# Altium project 3DAS_4Camera.PrjPcb (part 6 of 10)

## Sheet [11] HUB USB3.0.SchDoc
size A3; DocumentNumber: 11; SheetNumber: 11; SheetTotal: 16
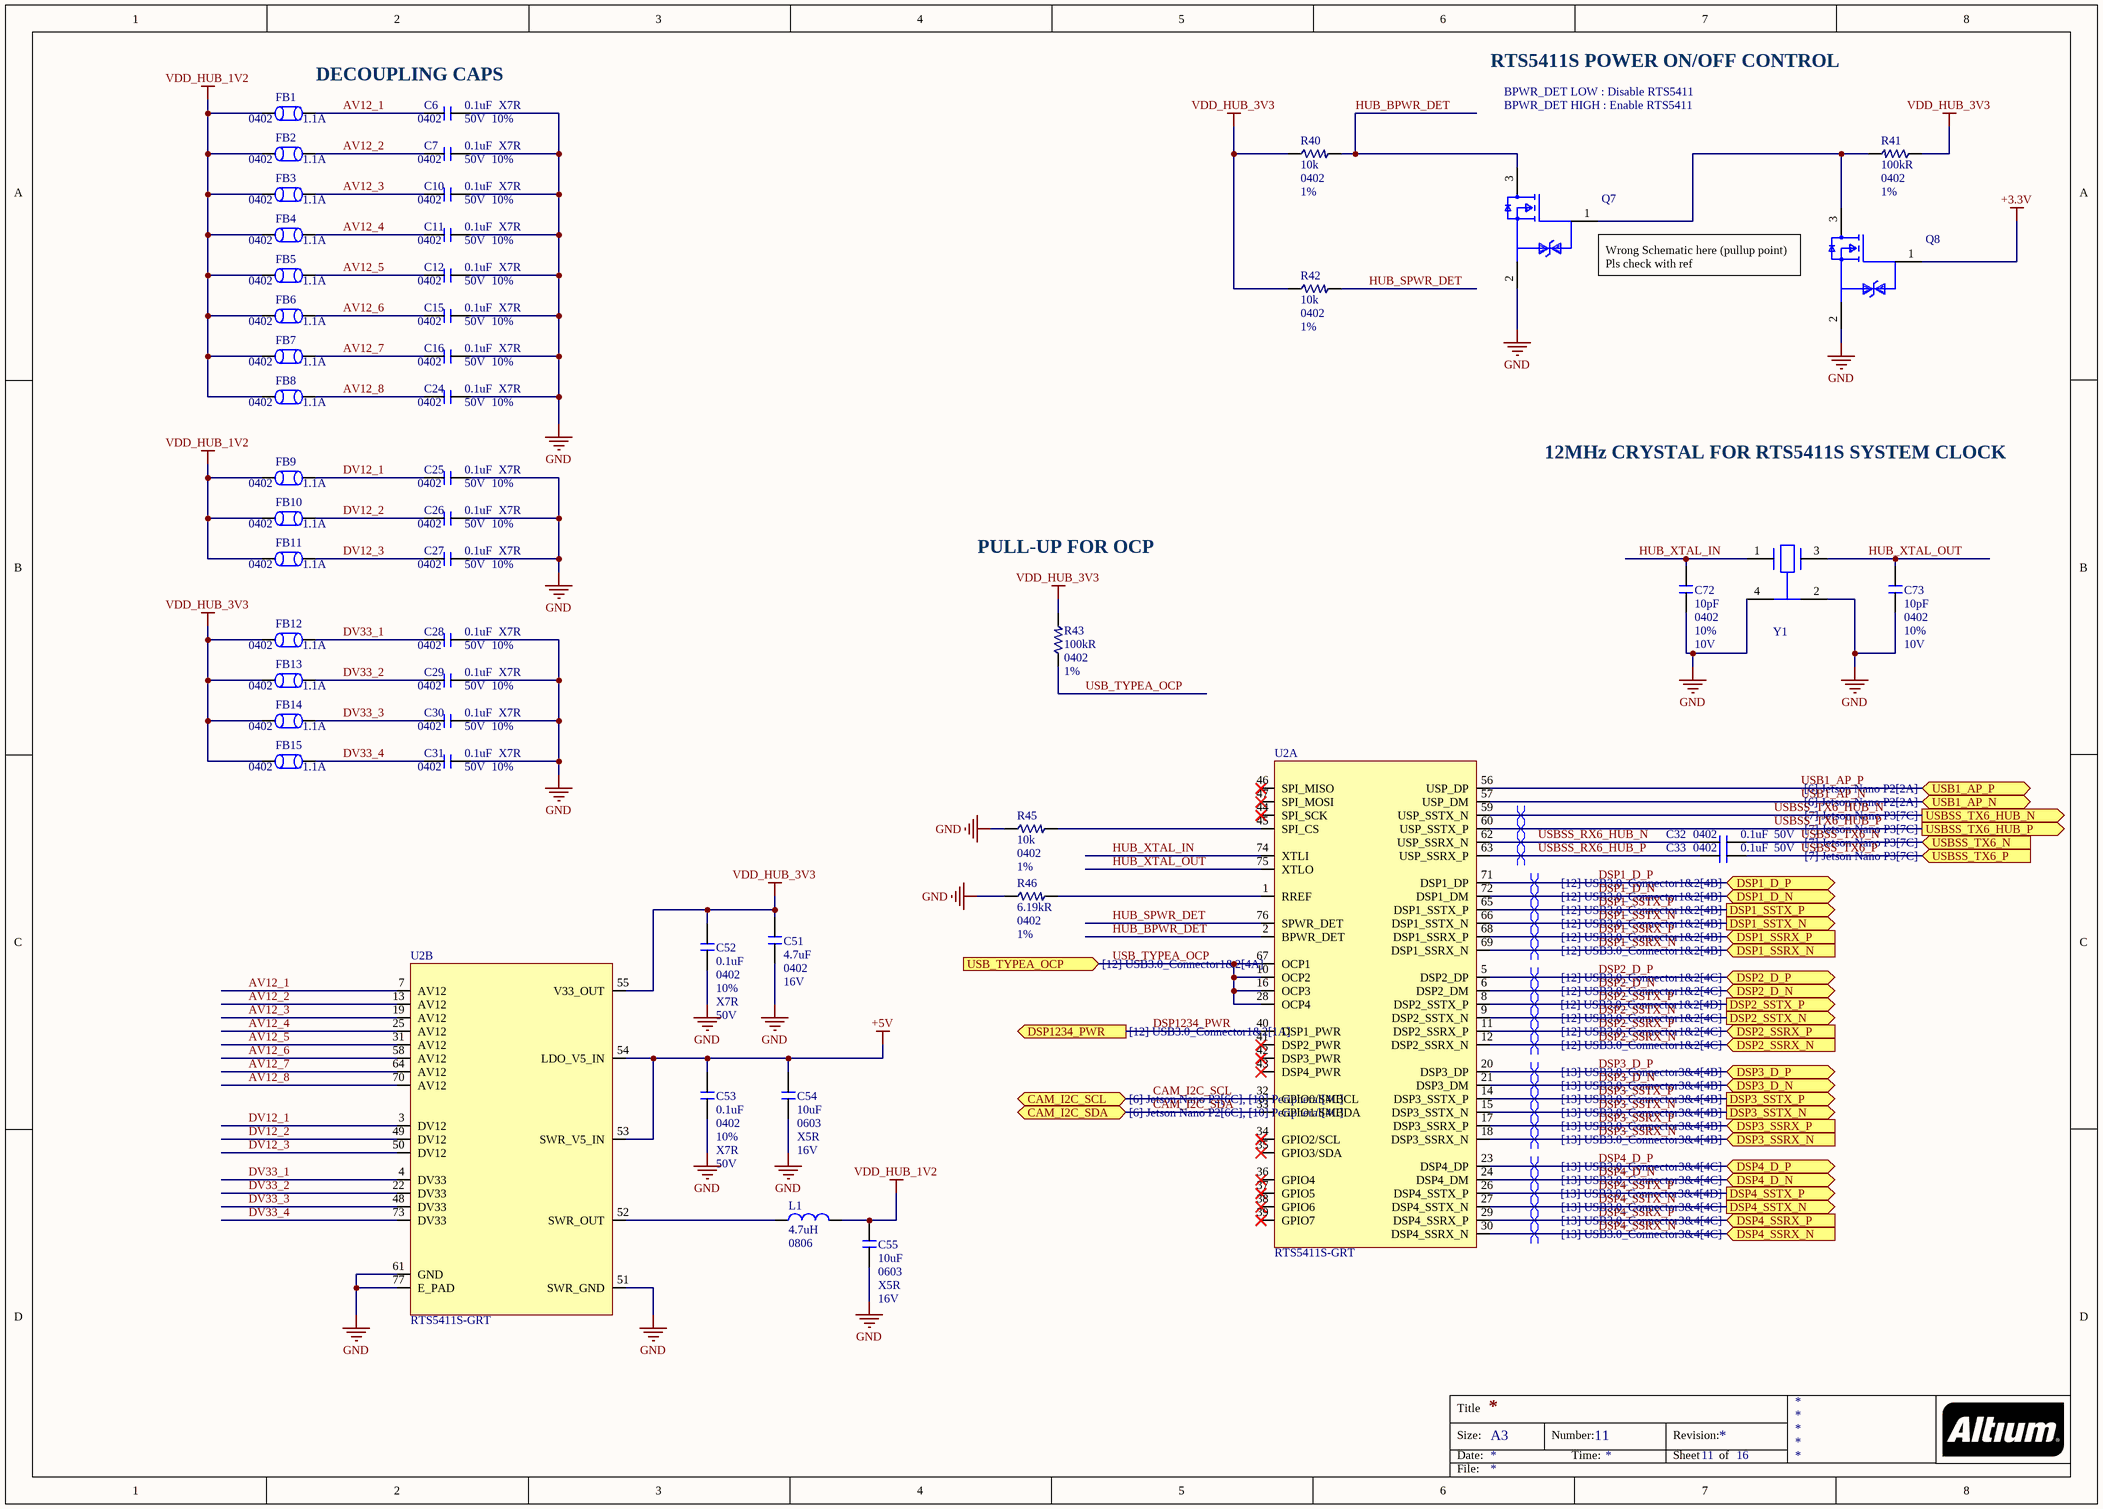
[diagram p10: [11] HUB USB3.0.SchDoc]

### Parts
C6  0.1uF  Case/Package: 0402  Tolerance: 10%  Dielectric: X7R  Voltage: 50V  [C0402M]
C7  0.1uF  Case/Package: 0402  Tolerance: 10%  Dielectric: X7R  Voltage: 50V  [C0402M]
C10  0.1uF  Case/Package: 0402  Tolerance: 10%  Dielectric: X7R  Voltage: 50V  [C0402M]
C11  0.1uF  Case/Package: 0402  Tolerance: 10%  Dielectric: X7R  Voltage: 50V  [C0402M]
C12  0.1uF  Case/Package: 0402  Tolerance: 10%  Dielectric: X7R  Voltage: 50V  [C0402M]
C15  0.1uF  Case/Package: 0402  Tolerance: 10%  Dielectric: X7R  Voltage: 50V  [C0402M]
C16  0.1uF  Case/Package: 0402  Tolerance: 10%  Dielectric: X7R  Voltage: 50V  [C0402M]
C24  0.1uF  Case/Package: 0402  Tolerance: 10%  Dielectric: X7R  Voltage: 50V  [C0402M]
C25  0.1uF  Case/Package: 0402  Tolerance: 10%  Dielectric: X7R  Voltage: 50V  [C0402M]
C26  0.1uF  Case/Package: 0402  Tolerance: 10%  Dielectric: X7R  Voltage: 50V  [C0402M]
C27  0.1uF  Case/Package: 0402  Tolerance: 10%  Dielectric: X7R  Voltage: 50V  [C0402M]
C28  0.1uF  Case/Package: 0402  Tolerance: 10%  Dielectric: X7R  Voltage: 50V  [C0402M]
C29  0.1uF  Case/Package: 0402  Tolerance: 10%  Dielectric: X7R  Voltage: 50V  [C0402M]
C30  0.1uF  Case/Package: 0402  Tolerance: 10%  Dielectric: X7R  Voltage: 50V  [C0402M]
C31  0.1uF  Case/Package: 0402  Tolerance: 10%  Dielectric: X7R  Voltage: 50V  [C0402M]
C32  0.1uF  Case/Package: 0402  Voltage: 50V  [C0402M]
C33  0.1uF  Case/Package: 0402  Voltage: 50V  [C0402M]
C51  4.7uF  Case/Package: 0402  Voltage Rating: 16V  [C0402M]
C52  0.1uF  Case/Package: 0402  Tolerance: 10%  Dielectric: X7R  Voltage: 50V  [C0402M]
C53  0.1uF  Case/Package: 0402  Tolerance: 10%  Dielectric: X7R  Voltage: 50V  [C0402M]
C54  10uF  Case/Package: 0603  Dielectric: X5R  Voltage Rating (DC): 16V  [C0603M]
C55  10uF  Case/Package: 0603  Dielectric: X5R  Voltage Rating (DC): 16V  [C0603M]
C72  10pF  Case/Package: 0402  Tolerance: 10%  Voltage Rating: 10V  [C0402M]
C73  10pF  Case/Package: 0402  Tolerance: 10%  Voltage Rating: 10V  [C0402M]
FB1  Case Code (Imperial): 0402  Current Rating: 1.1A  [R0402M]  (hidden comment: BLM15AX300SN1D)
FB2  Case Code (Imperial): 0402  Current Rating: 1.1A  [R0402M]  (hidden comment: BLM15AX300SN1D)
FB3  Case Code (Imperial): 0402  Current Rating: 1.1A  [R0402M]  (hidden comment: BLM15AX300SN1D)
FB4  Case Code (Imperial): 0402  Current Rating: 1.1A  [R0402M]  (hidden comment: BLM15AX300SN1D)
FB5  Case Code (Imperial): 0402  Current Rating: 1.1A  [R0402M]  (hidden comment: BLM15AX300SN1D)
FB6  Case Code (Imperial): 0402  Current Rating: 1.1A  [R0402M]  (hidden comment: BLM15AX300SN1D)
FB7  Case Code (Imperial): 0402  Current Rating: 1.1A  [R0402M]  (hidden comment: BLM15AX300SN1D)
FB8  Case Code (Imperial): 0402  Current Rating: 1.1A  [R0402M]  (hidden comment: BLM15AX300SN1D)
FB9  Case Code (Imperial): 0402  Current Rating: 1.1A  [R0402M]  (hidden comment: BLM15AX300SN1D)
FB10  Case Code (Imperial): 0402  Current Rating: 1.1A  [R0402M]  (hidden comment: BLM15AX300SN1D)
FB11  Case Code (Imperial): 0402  Current Rating: 1.1A  [R0402M]  (hidden comment: BLM15AX300SN1D)
FB12  Case Code (Imperial): 0402  Current Rating: 1.1A  [R0402M]  (hidden comment: BLM15AX300SN1D)
FB13  Case Code (Imperial): 0402  Current Rating: 1.1A  [R0402M]  (hidden comment: BLM15AX300SN1D)
FB14  Case Code (Imperial): 0402  Current Rating: 1.1A  [R0402M]  (hidden comment: BLM15AX300SN1D)
FB15  Case Code (Imperial): 0402  Current Rating: 1.1A  [R0402M]  (hidden comment: BLM15AX300SN1D)
L1  4.7uH  Case Code (Imperial): 0806  [IND_0805]
Q7  DMN26D0UFB4-7  [Diodes_Inc_X2-DFN1006-3_MFG]  (value not drawn)
Q8  DMN26D0UFB4-7  [Diodes_Inc_X2-DFN1006-3_MFG]  (value not drawn)
R40  10k  Case Code (Imperial): 0402  Tolerance: 1%  [R0402M]
R41  100kR  Case/Package: 0402  Tolerance: 1%  [R0402M]
R42  10k  Case Code (Imperial): 0402  Tolerance: 1%  [R0402M]
R43  100kR  Case/Package: 0402  Tolerance: 1%  [R0402M]
R45  10k  Case Code (Imperial): 0402  Tolerance: 1%  [R0402M]
R46  6.19kR  Case/Package: 0402  Tolerance: 1%  [R0402M]
U2  RTS5411S-GRT  [QFN40P900X900X90_HS-77N]  (parts A,B of 2)
Y1  ABM8G-12.000MHZ-4Y-T3  [Abracon_ABM8G_0]  (value not drawn)

### Ports
CAM_I2C_SCL (bidir, see [6] Jetson Nano P2[6C], [10] Peripheral[4C]), CAM_I2C_SDA (bidir, see [6] Jetson Nano P2[6C], [10] Peripheral[4C]), DSP1_D_N (bidir, see [12] USB3.0_Connector1&2[4B]), DSP1_D_P (bidir, see [12] USB3.0_Connector1&2[4B]), DSP1_SSRX_N (in, see [12] USB3.0_Connector1&2[4B]), DSP1_SSRX_P (in, see [12] USB3.0_Connector1&2[4B]), DSP1_SSTX_N (out, see [12] USB3.0_Connector1&2[4B]), DSP1_SSTX_P (out, see [12] USB3.0_Connector1&2[4B]), DSP2_D_N (bidir, see [12] USB3.0_Connector1&2[4C]), DSP2_D_P (bidir, see [12] USB3.0_Connector1&2[4C]), DSP2_SSRX_N (in, see [12] USB3.0_Connector1&2[4C]), DSP2_SSRX_P (in, see [12] USB3.0_Connector1&2[4C]), DSP2_SSTX_N (out, see [12] USB3.0_Connector1&2[4C]), DSP2_SSTX_P (out, see [12] USB3.0_Connector1&2[4D]), DSP3_D_N (bidir, see [13] USB3.0_Connector3&4[4B]), DSP3_D_P (bidir, see [13] USB3.0_Connector3&4[4B]), DSP3_SSRX_N (in, see [13] USB3.0_Connector3&4[4B]), DSP3_SSRX_P (in, see [13] USB3.0_Connector3&4[4B]), DSP3_SSTX_N (out, see [13] USB3.0_Connector3&4[4B]), DSP3_SSTX_P (out, see [13] USB3.0_Connector3&4[4B]), DSP4_D_N (bidir, see [13] USB3.0_Connector3&4[4C]), DSP4_D_P (bidir, see [13] USB3.0_Connector3&4[4C]), DSP4_SSRX_N (in, see [13] USB3.0_Connector3&4[4C]), DSP4_SSRX_P (in, see [13] USB3.0_Connector3&4[4C]), DSP4_SSTX_N (out, see [13] USB3.0_Connector3&4[4C]), DSP4_SSTX_P (out, see [13] USB3.0_Connector3&4[4D]), DSP1234_PWR (out, see [12] USB3.0_Connector1&2[1A]), USB1_AP_N (bidir, see [6] Jetson Nano P2[2A]), USB1_AP_P (bidir, see [6] Jetson Nano P2[2A]), USB_TYPEA_OCP (in, see [12] USB3.0_Connector1&2[4A]), USBSS_TX6_HUB_N (out, see [7] Jetson Nano P3[7C]), USBSS_TX6_HUB_P (out, see [7] Jetson Nano P3[7C]), USBSS_TX6_N (in, see [7] Jetson Nano P3[7C]), USBSS_TX6_P (in, see [7] Jetson Nano P3[7C])

### Nets
+3.3V: Q8.1(G)
+5V: C53.1 C54.2 U2.53(SWR_V5_IN) U2.54(LDO_V5_IN)
GND: C6.2 C7.2 C10.2 C11.2 C12.2 C15.2 C16.2 C24.2 C25.2 C26.2 C27.2 C28.2 C29.2 C30.2 C31.2 C51.2 C52.2 C53.2 C54.1 C55.1 C72.2 C73.2 Q7.2(S) Q8.2(S) R45.2 R46.2 U2.51(SWR_GND) U2.61(GND) U2.77(E_PAD) Y1.2(GND) Y1.4(GND)
VDD_HUB_1V2: C55.2 FB1.2 FB2.2 FB3.2 FB4.2 FB5.2 FB6.2 FB7.2 FB8.2 FB9.2 FB10.2 FB11.2 L1.2
VDD_HUB_3V3: C51.1 C52.1 FB12.2 FB13.2 FB14.2 FB15.2 R40.2 R41.2 R42.2 R43.1 U2.55(V33_OUT)
AV12_1: C6.1 FB1.1 U2.7(AV12)
AV12_2: C7.1 FB2.1 U2.13(AV12)
AV12_3: C10.1 FB3.1 U2.19(AV12)
AV12_4: C11.1 FB4.1 U2.25(AV12)
AV12_5: C12.1 FB5.1 U2.31(AV12)
AV12_6: C15.1 FB6.1 U2.58(AV12)
AV12_7: C16.1 FB7.1 U2.64(AV12)
AV12_8: C24.1 FB8.1 U2.70(AV12)
CAM_I2C_SCL: U2.32(GPIO0/SMBCL) ; port CAM_I2C_SCL
CAM_I2C_SDA: U2.33(GPIO1/SMBDA) ; port CAM_I2C_SDA
DSP1_D_N: U2.72(DSP1_DM) ; port DSP1_D_N
DSP1_D_P: U2.71(DSP1_DP) ; port DSP1_D_P
DSP1_SSRX_N: U2.69(DSP1_SSRX_N) ; port DSP1_SSRX_N
DSP1_SSRX_P: U2.68(DSP1_SSRX_P) ; port DSP1_SSRX_P
DSP1_SSTX_N: U2.66(DSP1_SSTX_N) ; port DSP1_SSTX_N
DSP1_SSTX_P: U2.65(DSP1_SSTX_P) ; port DSP1_SSTX_P
DSP2_D_N: U2.6(DSP2_DM) ; port DSP2_D_N
DSP2_D_P: U2.5(DSP2_DP) ; port DSP2_D_P
DSP2_SSRX_N: U2.12(DSP2_SSRX_N) ; port DSP2_SSRX_N
DSP2_SSRX_P: U2.11(DSP2_SSRX_P) ; port DSP2_SSRX_P
DSP2_SSTX_N: U2.9(DSP2_SSTX_N) ; port DSP2_SSTX_N
DSP2_SSTX_P: U2.8(DSP2_SSTX_P) ; port DSP2_SSTX_P
DSP3_D_N: U2.21(DSP3_DM) ; port DSP3_D_N
DSP3_D_P: U2.20(DSP3_DP) ; port DSP3_D_P
DSP3_SSRX_N: U2.18(DSP3_SSRX_N) ; port DSP3_SSRX_N
DSP3_SSRX_P: U2.17(DSP3_SSRX_P) ; port DSP3_SSRX_P
DSP3_SSTX_N: U2.15(DSP3_SSTX_N) ; port DSP3_SSTX_N
DSP3_SSTX_P: U2.14(DSP3_SSTX_P) ; port DSP3_SSTX_P
DSP4_D_N: U2.24(DSP4_DM) ; port DSP4_D_N
DSP4_D_P: U2.23(DSP4_DP) ; port DSP4_D_P
DSP4_SSRX_N: U2.30(DSP4_SSRX_N) ; port DSP4_SSRX_N
DSP4_SSRX_P: U2.29(DSP4_SSRX_P) ; port DSP4_SSRX_P
DSP4_SSTX_N: U2.27(DSP4_SSTX_N) ; port DSP4_SSTX_N
DSP4_SSTX_P: U2.26(DSP4_SSTX_P) ; port DSP4_SSTX_P
DSP1234_PWR: U2.40(DSP1_PWR) ; port DSP1234_PWR
DV12_1: C25.1 FB9.1 U2.3(DV12)
DV12_2: C26.1 FB10.1 U2.49(DV12)
DV12_3: C27.1 FB11.1 U2.50(DV12)
DV33_1: C28.1 FB12.1 U2.4(DV33)
DV33_2: C29.1 FB13.1 U2.22(DV33)
DV33_3: C30.1 FB14.1 U2.48(DV33)
DV33_4: C31.1 FB15.1 U2.73(DV33)
HUB_BPWR_DET: Q7.3(D) R40.1 U2.2(BPWR_DET)
HUB_SPWR_DET: R42.1 U2.76(SPWR_DET)
HUB_XTAL_IN: C72.1 U2.74(XTLI) Y1.1
HUB_XTAL_OUT: C73.1 U2.75(XTLO) Y1.3
USB1_AP_N: U2.57(USP_DM) ; port USB1_AP_N
USB1_AP_P: U2.56(USP_DP) ; port USB1_AP_P
USB_TYPEA_OCP: R43.2 U2.10(OCP2) U2.16(OCP3) U2.28(OCP4) U2.67(OCP1) ; port USB_TYPEA_OCP
USBSS_RX6_HUB_N: C32.1 U2.62(USP_SSRX_N)
USBSS_RX6_HUB_P: C33.1 U2.63(USP_SSRX_P)
USBSS_TX6_HUB_N: U2.59(USP_SSTX_N) ; port USBSS_TX6_HUB_N
USBSS_TX6_HUB_P: U2.60(USP_SSTX_P) ; port USBSS_TX6_HUB_P
USBSS_TX6_N: C32.2 ; port USBSS_TX6_N
USBSS_TX6_P: C33.2 ; port USBSS_TX6_P
NetL1_1: L1.1 U2.52(SWR_OUT)
NetQ7_1: Q7.1(G) Q8.3(D) R41.1
NetR45_1: R45.1 U2.45(SPI_CS)
NetR46_1: R46.1 U2.1(RREF)

Not connected (* = marked no-connect by the designer): U2 34(GPIO2/SCL)* 35(GPIO3/SDA)* 36(GPIO4)* 37(GPIO5)* 38(GPIO6)* 39(GPIO7)* 41(DSP2_PWR)* 42(DSP3_PWR)* 43(DSP4_PWR)* 44(SPI_SCK)* 46(SPI_MISO)* 47(SPI_MOSI)*

### Layout directives
differential pair; differential pair class DIFF100; net class DIFF100: DSP1_D_N, DSP1_D_P, DSP1_SSRX_N, DSP1_SSRX_P, DSP1_SSTX_N, DSP1_SSTX_P, DSP2_D_N, DSP2_D_P, DSP2_SSRX_N, DSP2_SSRX_P, DSP2_SSTX_N, DSP2_SSTX_P, DSP3_D_N, DSP3_D_P, DSP3_SSRX_N, DSP3_SSRX_P, DSP3_SSTX_N, DSP3_SSTX_P, DSP4_D_N, DSP4_D_P, DSP4_SSRX_N, DSP4_SSRX_P, DSP4_SSTX_N, DSP4_SSTX_P, USBSS_RX6_HUB_N, USBSS_RX6_HUB_P, USBSS_TX6_HUB_N, USBSS_TX6_HUB_P

### Notes on the sheet
- DECOUPLING CAPS
- RTS5411S POWER ON/OFF CONTROL
- BPWR_DET LOW : Disable RTS5411
- BPWR_DET HIGH : Enable RTS5411
- Wrong Schematic here (pullup point)
  Pls check with ref
- 12MHz CRYSTAL FOR RTS5411S SYSTEM CLOCK
- PULL-UP FOR OCP
- Title
- Size:
- Date:
- A3
- Number:
- Time:
- Revision:
- Sheet
- of
- File:

### Library data of the parts
C6 C7 C10-C12 C15 C16 C24-C31 C52 C53 = CAP_CER: CAP CER 0.1UF 50V X7R 0402; Manufacturer: Murata; Manufacturer Part Number: GRM155R71H104KE14D; Material: Ceramic; Capacitance: 100nF; Dissipation Factor: 0.025%; ComponentLink1URL: https://datasheet.ciiva.com/25741/cl10b104kb8nnnl-25741341.pdf?src-supplier=Digi-Key; ComponentLink1Description: https://datasheet.ciiva.com/25741/cl10b104kb8nnnl-25741341.pdf?src-supplier=Digi-Key; ComponentLink2URL: https://datasheet.ciiva.com/26838/getdatasheetpartid-357523-26838415.pdf?src-supplier=Verical; ComponentLink2Description: https://datasheet.ciiva.com/26838/getdatasheetpartid-357523-26838415.pdf?src-supplier=Verical; Supplier 1: Digi-Key; Supplier Part Number 1: 490-10700-1-ND; Stock 1: 2282266; Pricing 1: 1 = 0.10000, 10 = 0.04600, 100 = 0.02050, 500 = 0.01464, 1000 = 0.01150, 2500 = 0.01045, 5000 = 0.00961 (USD); RoHS: Yes; Mount: Surface Mount; Weight: 0.000212oz; Case Code (Metric): 1005; Case Code (Imperial): 0402; Dielectric Material: Ceramic; Min Operating Temperature: -55°C; Max Operating Temperature: 125°C; Packaging: Tape and Reel; Voltage Rating: 50V; Termination: SMD/SMT; Composition: Ceramic; Voltage Rating (DC): 50V; Package Quantity: 10000; Length: 1mm; Height: 0.5mm; Width: 0.5mm; Thickness: 0.022inch; Depth: 0.5mm; REACH SVHC: No SVHC; Lead Free: Lead Free; ComponentLink3URL: http://www.farnell.com/datasheets/2079156.pdf?src-supplier=Farnell; ComponentLink3Description: http://www.farnell.com/datasheets/2079156.pdf?src-supplier=Farnell; ComponentLink4URL: http://www.mouser.com/ds/2/281/c02e-2905.pdf?src-supplier=Mouser; ComponentLink4Description: http://www.mouser.com/ds/2/281/c02e-2905.pdf?src-supplier=Mouser; ComponentLink5URL: http://components.arrow.com/part/dataview/0323_07030614?src-supplier=Arrow+Europe; ComponentLink5Description: http://components.arrow.com/part/dataview/0323_07030614?src-supplier=Arrow+Europe; ComponentLink6URL: https://search.murata.co.jp/Ceramy/image/img/A01X/G101/ENG/GRM155R71H104KE14-01.pdf?src-supplier=Digi-Key; ComponentLink6Description: https://search.murata.co.jp/Ceramy/image/img/A01X/G101/ENG/GRM155R71H104KE14-01.pdf?src-supplier=Digi-Key; ComponentLink7URL: http://psearch.en.murata.com/capacitor/product/GRM155R71H104KE14%23.pdf?src-supplier=Avnet; ComponentLink7Description: http://psearch.en.murata.com/capacitor/product/GRM155R71H104KE14%23.pdf?src-supplier=Avnet; ComponentLink8URL: http://www.farnell.com/datasheets/2079156.pdf?src-supplier=Element14; ComponentLink8Description: http://www.farnell.com/datasheets/2079156.pdf?src-supplier=Element14; ComponentLink9URL: http://www.farnell.com/datasheets/2079156.pdf?src-supplier=Newark; ComponentLink9Description: http://www.farnell.com/datasheets/2079156.pdf?src-supplier=Newark
C32 C33 = CAP_CER: CAP CER 0.1UF 50V X7R 0402; Manufacturer: Murata; Manufacturer Part Number: GRM155R71H104KE14D; Material: Ceramic; Tolerance: 10%; Capacitance: 100nF; Dissipation Factor: 0.025%; ComponentLink1URL: https://datasheet.ciiva.com/25741/cl10b104kb8nnnl-25741341.pdf?src-supplier=Digi-Key; ComponentLink1Description: https://datasheet.ciiva.com/25741/cl10b104kb8nnnl-25741341.pdf?src-supplier=Digi-Key; ComponentLink2URL: https://datasheet.ciiva.com/26838/getdatasheetpartid-357523-26838415.pdf?src-supplier=Verical; ComponentLink2Description: https://datasheet.ciiva.com/26838/getdatasheetpartid-357523-26838415.pdf?src-supplier=Verical; Supplier 1: Digi-Key; Supplier Part Number 1: 490-10700-1-ND; Stock 1: 2282266; Pricing 1: 1 = 0.10000, 10 = 0.04600, 100 = 0.02050, 500 = 0.01464, 1000 = 0.01150, 2500 = 0.01045, 5000 = 0.00961 (USD); RoHS: Yes; Mount: Surface Mount; Weight: 0.000212oz; Case Code (Metric): 1005; Case Code (Imperial): 0402; Dielectric Material: Ceramic; Min Operating Temperature: -55°C; Max Operating Temperature: 125°C; Packaging: Tape and Reel; Dielectric: X7R; Voltage Rating: 50V; Termination: SMD/SMT; Composition: Ceramic; Voltage Rating (DC): 50V; Package Quantity: 10000; Length: 1mm; Height: 0.5mm; Width: 0.5mm; Thickness: 0.022inch; Depth: 0.5mm; REACH SVHC: No SVHC; Lead Free: Lead Free; ComponentLink3URL: http://www.farnell.com/datasheets/2079156.pdf?src-supplier=Farnell; ComponentLink3Description: http://www.farnell.com/datasheets/2079156.pdf?src-supplier=Farnell; ComponentLink4URL: http://www.mouser.com/ds/2/281/c02e-2905.pdf?src-supplier=Mouser; ComponentLink4Description: http://www.mouser.com/ds/2/281/c02e-2905.pdf?src-supplier=Mouser; ComponentLink5URL: http://components.arrow.com/part/dataview/0323_07030614?src-supplier=Arrow+Europe; ComponentLink5Description: http://components.arrow.com/part/dataview/0323_07030614?src-supplier=Arrow+Europe; ComponentLink6URL: https://search.murata.co.jp/Ceramy/image/img/A01X/G101/ENG/GRM155R71H104KE14-01.pdf?src-supplier=Digi-Key; ComponentLink6Description: https://search.murata.co.jp/Ceramy/image/img/A01X/G101/ENG/GRM155R71H104KE14-01.pdf?src-supplier=Digi-Key; ComponentLink7URL: http://psearch.en.murata.com/capacitor/product/GRM155R71H104KE14%23.pdf?src-supplier=Avnet; ComponentLink7Description: http://psearch.en.murata.com/capacitor/product/GRM155R71H104KE14%23.pdf?src-supplier=Avnet; ComponentLink8URL: http://www.farnell.com/datasheets/2079156.pdf?src-supplier=Element14; ComponentLink8Description: http://www.farnell.com/datasheets/2079156.pdf?src-supplier=Element14; ComponentLink9URL: http://www.farnell.com/datasheets/2079156.pdf?src-supplier=Newark; ComponentLink9Description: http://www.farnell.com/datasheets/2079156.pdf?src-supplier=Newark
C51 = CAP_CER: CAP CER 4.7UF 16V X5R 0402; Manufacturer: Samsung; Manufacturer Part Number: CL05A475MO5NUNC; Tolerance: 20%; ComponentLink1URL: https://datasheet.ciiva.com/25786/cl05a475mp5nrnc-25786963.pdf?src-supplier=Digi-Key; ComponentLink1Description: https://datasheet.ciiva.com/25786/cl05a475mp5nrnc-25786963.pdf?src-supplier=Digi-Key; ComponentLink2URL: https://datasheet.ciiva.com/16437/cl05b104kq5nnnc-16437353.pdf?src-supplier=Future+Electronics; ComponentLink2Description: https://datasheet.ciiva.com/16437/cl05b104kq5nnnc-16437353.pdf?src-supplier=Future+Electronics; Supplier 1: Digi-Key; Supplier Part Number 1: 1276-6836-6-ND; Stock 1: 1677309; Pricing 1: 1 = 0.45000, 10 = 0.32100, 100 = 0.21130, 500 = 0.15656, 1000 = 0.13307, 2500 = 0.12524, 5000 = 0.11741 (USD); RoHS: Yes; Mount: Surface Mount; Case Code (Imperial): 0402; Case Code (Metric): 1005; Min Operating Temperature: -55°C; Max Operating Temperature: 85°C; Packaging: Tape and Reel; Capacitance: 4.7uF; Length: 0.039inch; Width: 0.02inch; Thickness: 0.022inch; ComponentLink3URL: http://www.farnell.com/datasheets/2710653.pdf?src-supplier=Farnell; ComponentLink3Description: http://www.farnell.com/datasheets/2710653.pdf?src-supplier=Farnell; ComponentLink4URL: http://www.farnell.com/datasheets/2710653.pdf?src-supplier=Newark; ComponentLink4Description: http://www.farnell.com/datasheets/2710653.pdf?src-supplier=Newark; ComponentLink5URL: http://www.samsungsem.com/kr/support/product-search/mlcc/CL05A475MO5NUNC.jsp?src-supplier=Digi-Key; ComponentLink5Description: http://www.samsungsem.com/kr/support/product-search/mlcc/CL05A475MO5NUNC.jsp?src-supplier=Digi-Key
C54 C55 = CAP_CER: CAP CER 10UF 16V X5R 0603; Manufacturer: Taiyo Yuden; Manufacturer Part Number: EMK107BBJ106MA-T; Tolerance: 20%; Supplier 1: Digi-Key; Supplier Part Number 1: 587-3238-1-ND; RoHS: Yes; Category: Ceramic Capacitors; Stock 1: 599529; Pricing 1: 1=0.34000, 10=0.23400, 50=0.16400, 100=0.14060, 500=0.10544, 1000=0.08903 (USD); Mount: Surface Mount; Case Code (Metric): 1608; Case Code (Imperial): 0603; Min Operating Temperature: -55°C; Max Operating Temperature: 85°C; Capacitance: 10uF; Packaging: Tape and Reel; Voltage Rating: 16V; Package Quantity: 1; Termination: SMD/SMT; Series: M; Construction: Flat; Length: 0.063inch; Width: 0.031inch; Height: 0.8mm; Thickness: 0.031inch; RoHS Compliant: Yes; REACH SVHC: Unknown; Halogen Free: Halogen Free; ComponentLink1URL: https://datasheet.ciiva.com/6259/emk107bbj106ma-t-6259169.pdf?src-supplier=Digi-Key; ComponentLink1Description: https://datasheet.ciiva.com/6259/emk107bbj106ma-t-6259169.pdf?src-supplier=Digi-Key; ComponentLink2URL: https://datasheet.ciiva.com/15920/3emk107bbj106ma-t-15920482.pdf?src-supplier=Onlinecomponents.com; ComponentLink2Description: https://datasheet.ciiva.com/15920/3emk107bbj106ma-t-15920482.pdf?src-supplier=Onlinecomponents.com; ComponentLink3URL: https://datasheet.ciiva.com/34372/463emk107bbj106ma-t-34372674.pdf?src-supplier=Onlinecomponents.com; ComponentLink3Description: https://datasheet.ciiva.com/34372/463emk107bbj106ma-t-34372674.pdf?src-supplier=Onlinecomponents.com; ComponentLink4URL: https://datasheet.ciiva.com/6259/emk107bbj106ma-t-6259164.pdf?src-supplier=Digi-Key; ComponentLink4Description: https://datasheet.ciiva.com/6259/emk107bbj106ma-t-6259164.pdf?src-supplier=Digi-Key; ComponentLink5URL: https://datasheet.ciiva.com/6259/emk107bbj106ma-t-6259167.pdf?src-supplier=Digi-Key; ComponentLink5Description: https://datasheet.ciiva.com/6259/emk107bbj106ma-t-6259167.pdf?src-supplier=Digi-Key; ComponentLink6URL: https://datasheet.ciiva.com/13168/mlcc01-e-13168735.pdf?src-supplier=Mouser; ComponentLink6Description: https://datasheet.ciiva.com/13168/mlcc01-e-13168735.pdf?src-supplier=Mouser
C72 C73 = CAP_CER: Capacitor, Ceramic, 10pF, 10VDC, 10-% Tol, 10+% Tol, C0G-TC Code, -30, 30ppm-TC RoHS Compliant: Yes; Manufacturer 1: KEMET; Manufacturer Part Number 1: C0402C100K8GACTU; Dielectric: C0G; Dissipation Factor: 0.1%; Supplier 1: Mouser; Supplier Part Number 1: 80-C0402C100K8G; Stock 1: 9650; Pricing 1: 1=0.36000, 10=0.16500, 50=0.16500, 100=0.14100, 1000=0.08700, 10000=0.06600 (USD); RoHS: Yes; Mount: Surface Mount; Dielectric Material: Ceramic; Case Code (Metric): 1005; Case Code (Imperial): 0402; Min Operating Temperature: -55°C; Max Operating Temperature: 125°C; Capacitance: 10pF; Packaging: Tape and Reel; Voltage Rating (DC): 10V; Package Quantity: 10000; Termination: SMD/SMT; Series: C; Length: 1mm; Width: 0.02inch; Height: 0.5mm; Depth: 0.5mm; Thickness: 0.022inch; Lead Pitch: 0.3mm; Lead Free: Lead Free; RoHS Compliant: Yes; ComponentLink1URL: https://datasheet.ciiva.com/5427/kem-c1003-c0g-smd-356956-5427030.pdf?src-supplier=Mouser; ComponentLink1Description: https://datasheet.ciiva.com/5427/kem-c1003-c0g-smd-356956-5427030.pdf?src-supplier=Mouser
FB1-FB15 = FB: 0402 30Ω ±25% DCR=0.06Ω 1.1A 应用：信号线与电源线-超低直流电阻; Manufacturer 1: Murata; Impedance: 30R; Number of Lines: 1; DC Resistance (DCR): 60mR; Test Frequency: 100MHz; Supplier 1: Newark; Supplier Part Number 1: 76AH5004; Manufacturer Part Number 1: BLM15AX300SN1D; Stock 1: 2189; Pricing 1: 10=0.05500, 25=0.04700, 50=0.03800, 100=0.03000 (USD); RoHS: Yes; Case/Package: 0402; Number of Pins: 2; Case Code (Metric): 1005; Min Operating Temperature: -55°C; Max Operating Temperature: 125°C; Package Quantity: 1; Tolerance: 25%; Packaging: Tape and Reel; Max Current Rating: 1.1A; Max DC Current: 1.1A; Termination: SMD/SMT; Number of Circuits: 1; Series: BLM15AX_SN; Length: 0.039inch; Width: 0.02inch; Height: 0.022inch; Lead Free: Lead Free; RoHS Compliant: Yes; ComponentLink1URL: https://datasheet.ciiva.com/1012/l0110e-1012360.pdf?src-supplier=Digi-Key; ComponentLink1Description: https://datasheet.ciiva.com/1012/l0110e-1012360.pdf?src-supplier=Digi-Key; ComponentLink2URL: https://datasheet.ciiva.com/1012/l0110e-1012359.pdf?src-supplier=Digi-Key; ComponentLink2Description: https://datasheet.ciiva.com/1012/l0110e-1012359.pdf?src-supplier=Digi-Key; ComponentLink3URL: https://datasheet.ciiva.com/1012/l0110e-1012361.pdf?src-supplier=Digi-Key; ComponentLink3Description: https://datasheet.ciiva.com/1012/l0110e-1012361.pdf?src-supplier=Digi-Key
L1 = IND_SMD: 0806 4.7uH ±30% DCR=0.175Ω 0.8A SRF=20MHz; Manufacturer 1: Murata; Manufacturer Part Number 1: LQM2MPN4R7NG0L; Value: 150 mH; Core Material: Ferrite; Self Resonant Frequency: 20MHz; Shielding: Shielded; Current Rating: 1.1A; DC Resistance (DCR): 175mR; Test Frequency: 1MHz; Supplier 1: RSComponents; Supplier Part Number 1: 7867150; Stock 1: 490; Pricing 1: 10=0.43000, 50=0.36500, 100=0.32300, 250=0.28100, 1000=0.25900 (USD); RoHS: Yes; Mount: Surface Mount; Case/Package: 0806; Case Code (Metric): 2016; Min Operating Temperature: -40°C; Max Operating Temperature: 125°C; Tolerance: 30%; Packaging: Tape and Reel; Package Quantity: 1; Inductance: 4.7uH; Max DC Current: 1.1A; Termination: SMD/SMT; DC Current: 1.1A; Inductance Tolerance: 30%; Series: LQM2MPN_G0; Length: 2mm; Width: 1.6mm; Height: 0.9mm; Height - Seated (Max): 0.039inch; Depth: 1.6mm; REACH SVHC: No SVHC; Military Standard: Not; Lead Free: Lead Free; RoHS Compliant: Yes; ComponentLink1URL: https://datasheet.ciiva.com/30490/0900766b812561f8-30490187.pdf?src-supplier=RSComponents; ComponentLink1Description: https://datasheet.ciiva.com/30490/0900766b812561f8-30490187.pdf?src-supplier=RSComponents; ComponentLink2URL: https://datasheet.ciiva.com/4956/l0075s0104lqm2mp-g0-4956096.pdf?src-supplier=Mouser; ComponentLink2Description: https://datasheet.ciiva.com/4956/l0075s0104lqm2mp-g0-4956096.pdf?src-supplier=Mouser; ComponentLink3URL: https://datasheet.ciiva.com/3866/324lqm2mpn4r7ng023-3866492.pdf?src-supplier=Arrow+Electronics; ComponentLink3Description: https://datasheet.ciiva.com/3866/324lqm2mpn4r7ng023-3866492.pdf?src-supplier=Arrow+Electronics; ComponentLink4URL: https://datasheet.ciiva.com/29696/l0075s0104lqm2mp-g0-29696620.pdf?src-supplier=Digi-Key; ComponentLink4Description: https://datasheet.ciiva.com/29696/l0075s0104lqm2mp-g0-29696620.pdf?src-supplier=Digi-Key; ComponentLink5URL: https://datasheet.ciiva.com/29696/l0075s0104lqm2mp-g0-29696619.pdf?src-supplier=Digi-Key; ComponentLink5Description: https://datasheet.ciiva.com/29696/l0075s0104lqm2mp-g0-29696619.pdf?src-supplier=Digi-Key; ComponentLink6URL: https://datasheet.ciiva.com/29696/l0075s0104lqm2mp-g0-29696621.pdf?src-supplier=Digi-Key; ComponentLink6Description: https://datasheet.ciiva.com/29696/l0075s0104lqm2mp-g0-29696621.pdf?src-supplier=Digi-Key
Q7 Q8 = DMN26D0UFB4-7: N沟道 VDS=20V VGS=±10V ID=240mA P=350mW; Manufacturer 1: Diodes; Rise Time: 7.9ns; Rds On Max: 3R; Input Capacitance: 14.1pF; Continuous Drain Current (ID): 240mA; Drain to Source Resistance: 1.8R; Power Dissipation: 350mW; Turn-Off Delay Time: 13.4ns; Drain to Source Voltage (Vdss): 20V; Turn-On Delay Time: 3.8ns; Fall Time: 15.2ns; Number of Elements: 1; Element Configuration: Single; Gate to Source Voltage (Vgs): 10V; On-State Resistance: 10R; FET Type: 1 N-Channel; Polarity: N-CHANNEL; Supplier 1: Newark; Manufacturer Part Number 1: DMN26D0UFB4-7; Stock 1: 0; Pricing 1: 1=0.30000, 5=0.30000, 10=0.23100, 25=0.15700, 50=0.13000, 100=0.10900, 250=0.08700 (USD); RoHS: Yes; Mount: Surface Mount; Case/Package: DFN; Number of Pins: 3; Min Operating Temperature: -55°C; Max Operating Temperature: 150°C; Packaging: Tape and Reel; Package Quantity: 3000; Max Power Dissipation: 350mW; Number of Channels: 1; Series: -; Drain-source On Resistance-Max: 10R; Length: 1.05mm; Width: 0.65mm; Height: 0.35mm; Radiation Hardening: No; REACH SVHC: No SVHC; Lead Free: Lead Free; RoHS Compliant: Yes; ComponentLink1URL: https://datasheet.ciiva.com/4443/ds31775-89139-4443083.pdf?src-supplier=Mouser; ComponentLink1Description: https://datasheet.ciiva.com/4443/ds31775-89139-4443083.pdf?src-supplier=Mouser; ComponentLink2URL: https://datasheet.ciiva.com/11176/ds31775-11176556.pdf?src-supplier=Avnet; ComponentLink2Description: https://datasheet.ciiva.com/11176/ds31775-11176556.pdf?src-supplier=Avnet; ComponentLink3URL: https://datasheet.ciiva.com/16434/ds31775-16434037.pdf?src-supplier=Future+Electronics; ComponentLink3Description: https://datasheet.ciiva.com/16434/ds31775-16434037.pdf?src-supplier=Future+Electronics; ComponentLink4URL: https://datasheet.ciiva.com/48532/ds31775-48532486.pdf?src-supplier=Avnet; ComponentLink4Description: https://datasheet.ciiva.com/48532/ds31775-48532486.pdf?src-supplier=Avnet; ComponentLink5URL: https://datasheet.ciiva.com/934/ds31775-934573.pdf?src-supplier=Digi-Key; ComponentLink5Description: https://datasheet.ciiva.com/934/ds31775-934573.pdf?src-supplier=Digi-Key; ComponentLink6URL: https://datasheet.ciiva.com/934/ds31775-934574.pdf?src-supplier=Digi-Key; ComponentLink6Description: https://datasheet.ciiva.com/934/ds31775-934574.pdf?src-supplier=Digi-Key; ComponentLink7URL: https://datasheet.ciiva.com/934/ds31775-934572.pdf?src-supplier=Digi-Key; ComponentLink7Description: https://datasheet.ciiva.com/934/ds31775-934572.pdf?src-supplier=Digi-Key; Supplier Part Number 1: 28AK8523
R40 R42 R45 = RES_SMD: RES SMD 10K OHM 1% 1/16W 0402; Manufacturer: Yageo; Manufacturer Part Number: RC0402FR-0710KL; Resistance: 10kR; Temperature Coefficient: 100ppm/°C; Voltage Rating (DC): 50V; Power Rating: 62.5mW; Supplier 1: Digi-Key; Supplier Part Number 1: 311-10.0KLRTR-ND; Stock 1: 58760000; Pricing 1: 10000 = 0.001630, 30000 = 0.001440, 50000 = 0.001320, 100000 = 0.001290 (USD); RoHS: Yes; Case/Package: 0402; Number of Pins: 2; Case Code (Metric): 1005; Min Operating Temperature: -55°C; Max Operating Temperature: 155°C; Composition: Thick Film; Packaging: Tape and Reel; Voltage Rating: 50V; Termination: SMD/SMT; Military Standard: Not; Working Voltage: 50V; Number of Terminations: 2; Length: 1mm; Height: 0.32mm; Width: 0.5mm; Depth: 0.5mm; Lead Pitch: 0.2mm; REACH SVHC: No SVHC; Lead Free: Lead Free; ComponentLink1URL: https://datasheet.ciiva.com/7660/38568-7660787.pdf?src-supplier=Element14; ComponentLink1Description: https://datasheet.ciiva.com/7660/38568-7660787.pdf?src-supplier=Element14; ComponentLink2URL: https://datasheet.ciiva.com/7849/1784430-7849813.pdf?src-supplier=Element14; ComponentLink2Description: https://datasheet.ciiva.com/7849/1784430-7849813.pdf?src-supplier=Element14; ComponentLink3URL: https://datasheet.ciiva.com/7849/1686128-7849814.pdf?src-supplier=Element14; ComponentLink3Description: https://datasheet.ciiva.com/7849/1686128-7849814.pdf?src-supplier=Element14; ComponentLink4URL: https://datasheet.ciiva.com/7849/1784430-7849815.pdf?src-supplier=Element14; ComponentLink4Description: https://datasheet.ciiva.com/7849/1784430-7849815.pdf?src-supplier=Element14; ComponentLink5URL: https://datasheet.ciiva.com/22747/1018594-22747512.pdf?src-supplier=Element14; ComponentLink5Description: https://datasheet.ciiva.com/22747/1018594-22747512.pdf?src-supplier=Element14; ComponentLink6URL: https://datasheet.ciiva.com/12667/pyu-rc0402-51-rohs-l-6-r-12667067.pdf?src-supplier=Mouser; ComponentLink6Description: https://datasheet.ciiva.com/12667/pyu-rc0402-51-rohs-l-6-r-12667067.pdf?src-supplier=Mouser; ComponentLink7URL: https://datasheet.ciiva.com/7983/1018594-7983486.pdf?src-supplier=Element14; ComponentLink7Description: https://datasheet.ciiva.com/7983/1018594-7983486.pdf?src-supplier=Element14
R41 R43 = RES_SMD: 贴片电阻 100000Ω ± 1.00% 0.0625W ± 100ppm/℃ 0402; Manufacturer 1: Yageo; Manufacturer Part Number 1: RC0402FR-07100KL; Temperature Coefficient: 100ppm/°C; Power Rating: 63mW; Voltage Rating: 50V; Supplier 1: Newark; Supplier Part Number 1: 66R1125; Stock 1: 2470000; Pricing 1: 1=0.00500, 5000=0.00400, 10000=0.00300 (USD); RoHS: Yes; Case Code (Metric): 1005; Case Code (Imperial): 0402; Min Operating Temperature: -55°C; Max Operating Temperature: 155°C; Resistor Type: Thick Film; Resistance: 100kR; Packaging: Tape and Reel; Package Quantity: 1; Number of Terminations: 2; Termination: SMD/SMT; Max Power Dissipation: 63mW; Working Voltage: 50V; Features: Moisture Resistant; Series: RC; Resistance Tolerance: 1%; Construction: Rectangular; Technology: THICK FILM; Length: 0.039inch; Width: 0.02inch; Height: 0.016inch; Depth: 0.5mm; REACH SVHC: No SVHC; Lead Free: Lead Free; RoHS Compliant: Yes; Military Standard: Not; ComponentLink1URL: https://datasheet.ciiva.com/11819/0900766b80c66297-11819452.pdf?src-supplier=RSComponents; ComponentLink1Description: https://datasheet.ciiva.com/11819/0900766b80c66297-11819452.pdf?src-supplier=RSComponents; ComponentLink2URL: https://datasheet.ciiva.com/22747/1018594-22747509.pdf?src-supplier=Element14; ComponentLink2Description: https://datasheet.ciiva.com/22747/1018594-22747509.pdf?src-supplier=Element14; ComponentLink3URL: https://datasheet.ciiva.com/2453/pyu-r-int-thick-7-2453362.pdf?src-supplier=Digi-Key; ComponentLink3Description: https://datasheet.ciiva.com/2453/pyu-r-int-thick-7-2453362.pdf?src-supplier=Digi-Key; ComponentLink4URL: https://datasheet.ciiva.com/2453/pyu-r-int-thick-7-2453363.pdf?src-supplier=Digi-Key; ComponentLink4Description: https://datasheet.ciiva.com/2453/pyu-r-int-thick-7-2453363.pdf?src-supplier=Digi-Key; ComponentLink5URL: https://datasheet.ciiva.com/2453/pyu-r-int-thick-7-2453361.pdf?src-supplier=Digi-Key; ComponentLink5Description: https://datasheet.ciiva.com/2453/pyu-r-int-thick-7-2453361.pdf?src-supplier=Digi-Key; ComponentLink6URL: https://datasheet.ciiva.com/12667/pyu-rc0402-51-rohs-l-6-r-12667930.pdf?src-supplier=Mouser; ComponentLink6Description: https://datasheet.ciiva.com/12667/pyu-rc0402-51-rohs-l-6-r-12667930.pdf?src-supplier=Mouser; ComponentLink7URL: https://datasheet.ciiva.com/15189/getdatasheetpartid-323696-15189334.pdf?src-supplier=Verical; ComponentLink7Description: https://datasheet.ciiva.com/15189/getdatasheetpartid-323696-15189334.pdf?src-supplier=Verical
R46 = RES_SMD: 贴片电阻 6190Ω ± 1.00% 0.0625W ± 100ppm/℃ 0402; Manufacturer 1: Yageo; Manufacturer Part Number 1: RC0402FR-076K19L; Temperature Coefficient: 100ppm/°C; Power Rating: 62.5mW; Voltage Rating: 50V; Max Power Dissipation: 63mW; Supplier 1: Newark; Supplier Part Number 1: 82AH7981; Stock 1: 41537; Pricing 1: 1=0.07100, 10=0.00900, 25=0.00700, 50=0.00600, 100=0.00400 (USD); RoHS: Yes; Contact Plating: Tin,Matte; Case Code (Imperial): 0402; Case Code (Metric): 1005; Size Code: 0402; Min Operating Temperature: -55°C; Max Operating Temperature: 155°C; Resistance: 6.19kR; Resistor Type: Thick Film; Packaging: Tape and Reel; Termination: SMD/SMT; Voltage Rating (DC): 50V; Features: Moisture Resistant; Series: RC; Number of Terminations: 2; Construction: Rectangular; Length: 1mm; Depth: 0.5mm; Military Standard: Not; Lead Free: Lead Free; RoHS Compliant: Yes; ComponentLink1URL: https://datasheet.ciiva.com/8892/pyu-rc0402-51-rohs-l-6-8892361.pdf?src-supplier=Avnet; ComponentLink1Description: https://datasheet.ciiva.com/8892/pyu-rc0402-51-rohs-l-6-8892361.pdf?src-supplier=Avnet; ComponentLink2URL: https://datasheet.ciiva.com/17066/pyu-rc0402-51-rohs-l-6-r-17066229.pdf?src-supplier=Future+Electronics; ComponentLink2Description: https://datasheet.ciiva.com/17066/pyu-rc0402-51-rohs-l-6-r-17066229.pdf?src-supplier=Future+Electronics
U2 = RTS5411S-GRT: USB 3.0 Super-Speed HUB; Manufacturer 1: Realtek; Manufacturer Part Number 1: RTS5411T-GRT
Y1 = ABM8G-12.000MHZ-4Y-T3: 12MHz ±30ppm 晶体 10pF 120 欧姆 -10°C ~ 60°C  表面贴装 4-SMD，无引线（DFN，LCC）; Manufacturer 1: Abracon; ESR (Equivalent Series Resistance): 120R; Supplier 1: Newark; Manufacturer Part Number 1: ABM8G-12.000MHZ-4Y-T3; Stock 1: 6000; Pricing 1: 1=0.38900, 3000=0.38900 (USD); RoHS: Yes; Mount: Surface Mount; Case/Package: CSMD; Number of Pins: 4; Min Operating Temperature: -10°C; Max Operating Temperature: 60°C; Frequency: 12MHz; Load Capacitance: 10pF; Packaging: Tape and Reel; Frequency Tolerance: 30ppm; Frequency Stability: 30ppm; Series Resistance: 120R; Series: ABM8G; Operating Frequency: 12 MHz; Length: 3.2mm; Width: 0.098inch; Height: 0.039inch; Depth: 2.5mm; Lead Free: Lead Free; REACH SVHC: No SVHC; ComponentLink1URL: https://datasheet.ciiva.com/15116/getdatasheetpartid-719872-15116768.pdf?src-supplier=Verical; ComponentLink1Description: https://datasheet.ciiva.com/15116/getdatasheetpartid-719872-15116768.pdf?src-supplier=Verical; ComponentLink2URL: https://datasheet.ciiva.com/857/abm8g-857960.pdf?src-supplier=Digi-Key; ComponentLink2Description: https://datasheet.ciiva.com/857/abm8g-857960.pdf?src-supplier=Digi-Key; ComponentLink3URL: https://datasheet.ciiva.com/857/abm8g-857959.pdf?src-supplier=Digi-Key; ComponentLink3Description: https://datasheet.ciiva.com/857/abm8g-857959.pdf?src-supplier=Digi-Key; ComponentLink4URL: https://datasheet.ciiva.com/857/abm8g-857961.pdf?src-supplier=Digi-Key; ComponentLink4Description: https://datasheet.ciiva.com/857/abm8g-857961.pdf?src-supplier=Digi-Key; ComponentLink5URL: https://datasheet.ciiva.com/16216/abm8g-16216655.pdf?src-supplier=Future+Electronics; ComponentLink5Description: https://datasheet.ciiva.com/16216/abm8g-16216655.pdf?src-supplier=Future+Electronics; Supplier Part Number 1: 13AC8070